# Altium project Power Module (Type-A).PrjPcb
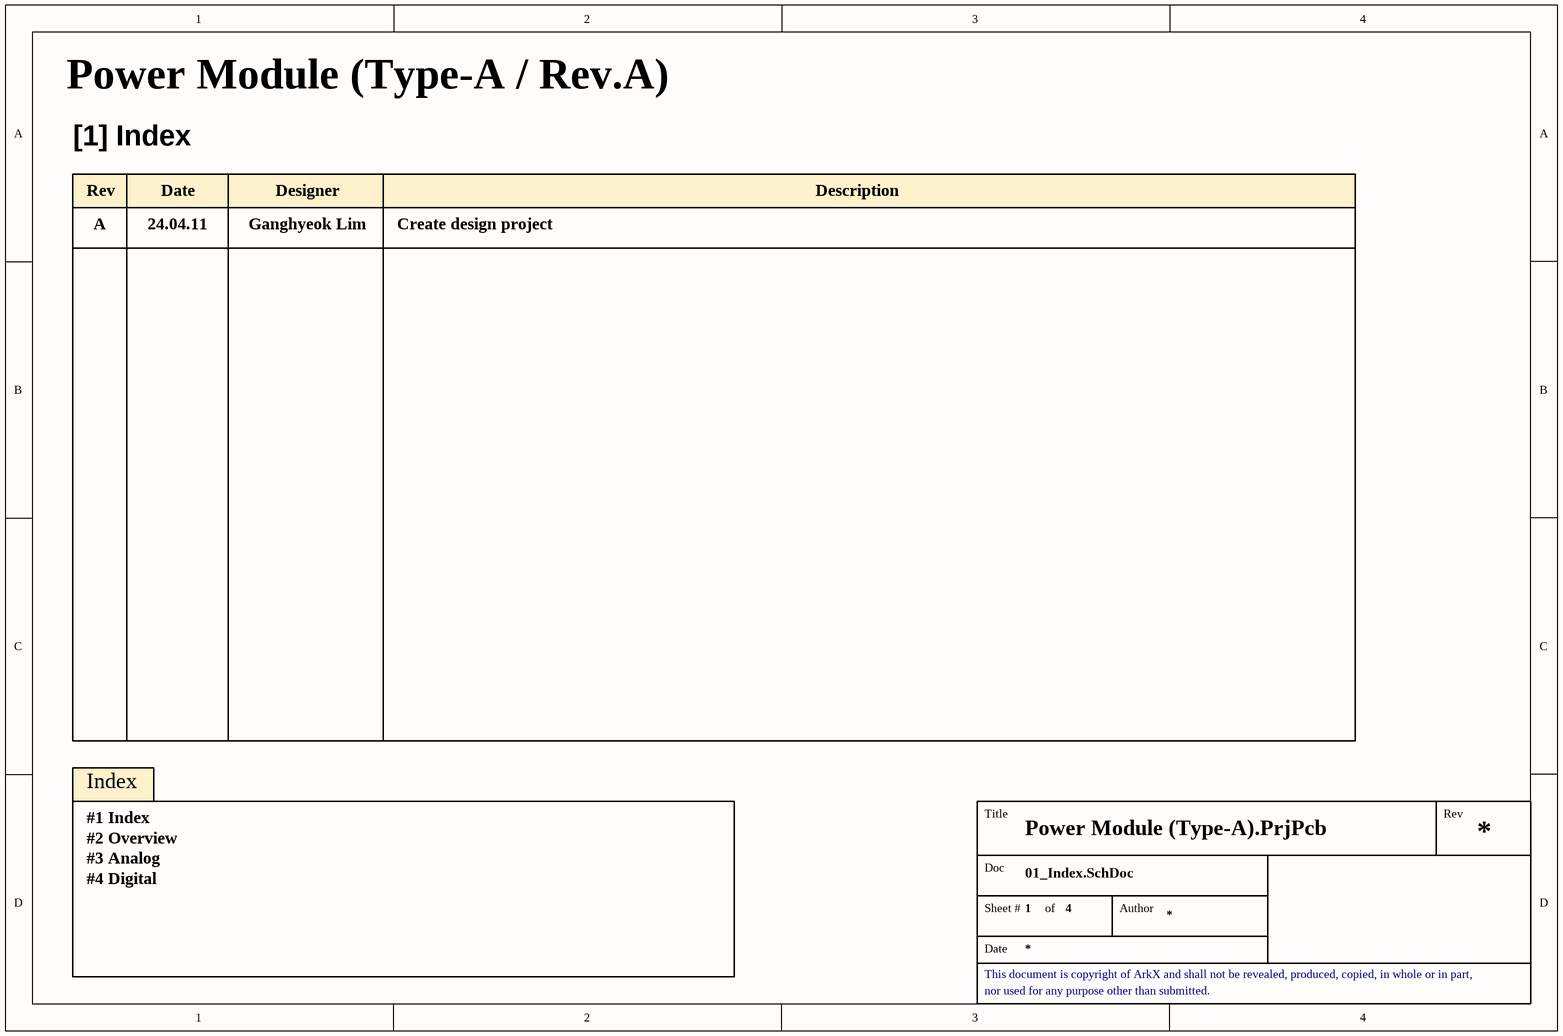
[diagram p0: 01_Index.SchDoc]
4 sheets, 55 parts. Net scope: global (net labels, ports and power ports of the same name join across sheets).
Board file: Power_Module_(Type-A).PcbDoc
Sheets:
  01_Index.SchDoc
  02_Overview.SchDoc
  03_DC-DC_Converter.SchDoc
  04_Connector.SchDoc

## Sheet 01_Index.SchDoc
size A4; SheetNumber: 1; SheetTotal: 4

### Notes on the sheet
- Power Module (Type-A / Rev.A)
- [1] Index
- Rev
- A
- 24.04.11
- Date
- Ganghyeok Lim
- Designer
- Create design project
- Description
- Index
- #1 Index
- #2 Overview
- #3 Analog
- #4 Digital
- Title
- Doc
- Sheet #
- of
- Author
- This document is copyright of ArkX and shall not be revealed, produced, copied, in whole or in part,
- nor used for any purpose other than submitted.

## Sheet 02_Overview.SchDoc
size A4; SheetNumber: 2; SheetTotal: 3
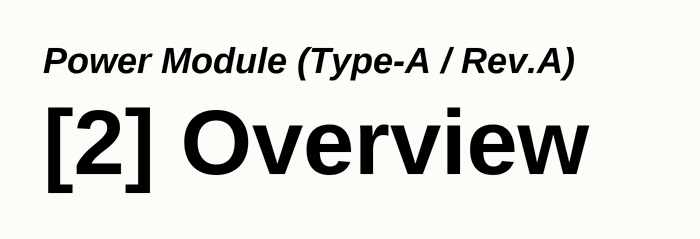
[diagram p1: 02_Overview.SchDoc]

### Notes on the sheet
- Power Module (Type-A / Rev.A)
- [2] Overview
- Title
- Rev
- Doc
- Sheet #
- of
- Author
- This document is copyright of ArkX and shall not be revealed, produced, copied, in whole or in part,
- Date
- nor used for any purpose other than submitted.

## Sheet 03_DC-DC_Converter.SchDoc
size A3; SheetNumber: 3; SheetTotal: 4
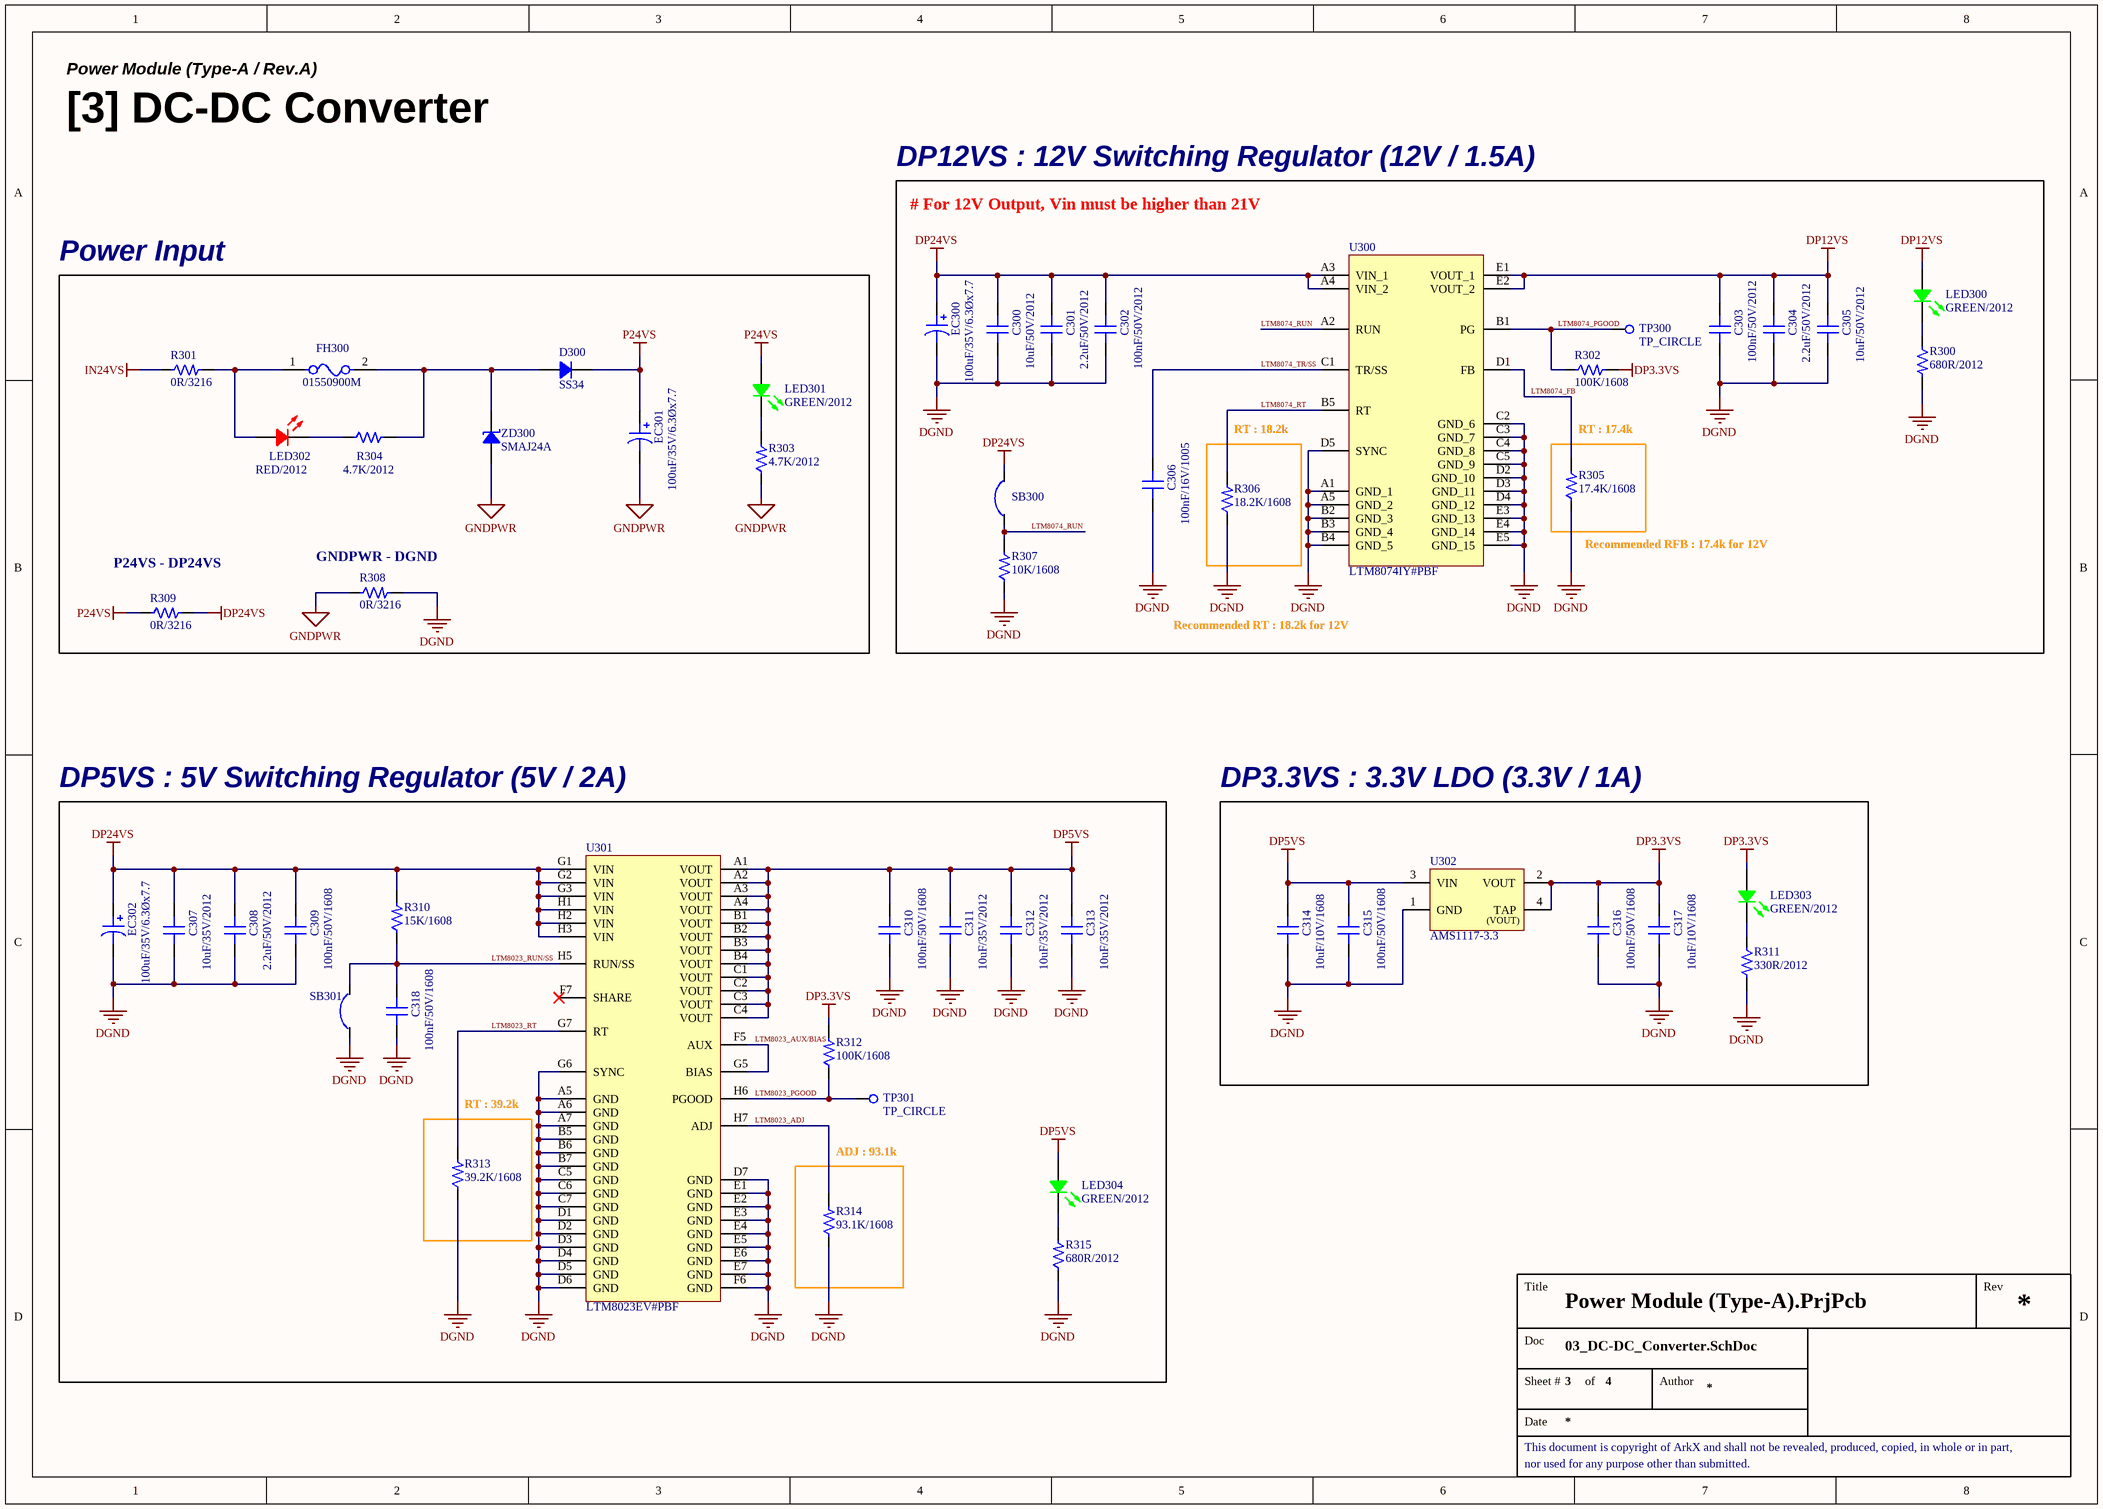
[diagram p2: 03_DC-DC_Converter.SchDoc]

### Parts
C300  10uF/50V/2012  [CAP 2012 (0805_INCH)]
C301  2.2uF/50V/2012  [CAP 2012 (0805_INCH)]
C302  100nF/50V/2012  [CAP 2012 (0805_INCH)]
C303  100nF/50V/2012  [CAP 2012 (0805_INCH)]
C304  2.2uF/50V/2012  [CAP 2012 (0805_INCH)]
C305  10uF/50V/2012  [CAP 2012 (0805_INCH)]
C306  100nF/16V/1005  [CAP 1005 (0402_INCH)]
C307  10uF/35V/2012  [CAP 2012 (0805_INCH)]
C308  2.2uF/50V/2012  [CAP 2012 (0805_INCH)]
C309  100nF/50V/1608  [CAP 1608 (0603_INCH)]
C310  100nF/50V/1608  [CAP 1608 (0603_INCH)]
C311  10uF/35V/2012  [CAP 2012 (0805_INCH)]
C312  10uF/35V/2012  [CAP 2012 (0805_INCH)]
C313  10uF/35V/2012  [CAP 2012 (0805_INCH)]
C314  10uF/10V/1608  [CAP 1608 (0603_INCH)]
C315  100nF/50V/1608  [CAP 1608 (0603_INCH)]
C316  100nF/50V/1608  [CAP 1608 (0603_INCH)]
C317  10uF/10V/1608  [CAP 1608 (0603_INCH)]
C318  100nF/50V/1608  [CAP 1608 (0603_INCH)]
D300  SS34  [DIO DO-214AC (SMA)]
EC300  100uF/35V/6.3Øx7.7  [CAP ALSMD 6.6MM H7.7MM]
EC301  100uF/35V/6.3Øx7.7  [CAP ALSMD 6.6MM H7.7MM]
EC302  100uF/35V/6.3Øx7.7  [CAP ALSMD 6.6MM H7.7MM]
FH300  01550900M  [FUSE 01550900M_SMD(Hand_Solder)]
LED300  GREEN/2012  [LED MHT170RGBCT (GREEN)]
LED301  GREEN/2012  [LED MHT170RGBCT (GREEN)]
LED302  RED/2012  [LED MHT170RGBCT (RED)]
LED303  GREEN/2012  [LED MHT170RGBCT (GREEN)]
LED304  GREEN/2012  [LED MHT170RGBCT (GREEN)]
R300  680R/2012  [RES 2012 (0805_inch)]
R301  0R/3216  [RES 3216 (1206_inch)]
R302  100K/1608  [RES 1608 (0603_inch)]
R303  4.7K/2012  [RES 2012 (0805_inch)]
R304  4.7K/2012  [RES 2012 (0805_inch)]
R305  17.4K/1608  [RES 1608 (0603_inch)]
R306  18.2K/1608  [RES 1608 (0603_inch)]
R307  10K/1608  [RES 1608 (0603_inch)]
R308  0R/3216  [RES 3216 (1206_inch)]
R309  0R/3216  [RES 3216 (1206_inch)]
R310  15K/1608  [RES 1608 (0603_inch)]
R311  330R/2012  [RES 2012 (0805_inch)]
R312  100K/1608  [RES 1608 (0603_inch)]
R313  39.2K/1608  [RES 1608 (0603_inch)]
R314  93.1K/1608  [RES 1608 (0603_inch)]
R315  680R/2012  [RES 2012 (0805_inch)]
SB300  SB  [SB (Solder-Bridge)]  (value not drawn)
SB301  SB  [SB (Solder-Bridge)]  (value not drawn)
TP300  TP_CIRCLE  [TP Circle]
TP301  TP_CIRCLE  [TP Circle]
U300  LTM8074IY#PBF  [IC_BGA-25]
U301  LTM8023EV#PBF  [LGA-50 (LTM8023EV#PBF)]
U302  AMS1117-3.3  [SOT 223-3 (DIODES INCORPORATED)]
ZD300  SMAJ24A  [DIO DO-214AC (SMA)]

### Blocks framed on the sheet
DP12VS : 12V Switching Regulator (12V / 1.5A): C300-C306 EC300 LED300 R300 R302 R307 SB300 TP300 U300
Power Input: D300 EC301 FH300 LED301 LED302 R301 R303 R304 R308 R309 ZD300
RT : 18.2k: R306
RT : 17.4k: R305
DP5VS : 5V Switching Regulator (5V / 2A): C307-C313 C318 EC302 LED304 R310 R312 R315 SB301 TP301 U301
DP3.3VS : 3.3V LDO (3.3V / 1A): C314-C317 LED303 R311 U302
RT : 39.2k: R313
ADJ : 93.1k: R314

### Nets
DGND: C300.1 C301.1 C302.1 C303.1 C304.1 C305.1 C306.1 C307.1 C308.1 C309.1 C310.1 C311.1 C312.1 C313.1 C314.1 C315.1 C316.1 C317.1 C318.1 EC300.2 EC302.2 R300.2 R305.1 R306.1 R307.1 R308.2 R311.2 R313.1 R314.1 R315.1 SB301.1 U300.A1(GND_1) U300.A5(GND_2) U300.B2(GND_3) U300.B3(GND_4) U300.B4(GND_5) U300.C2(GND_6) U300.C3(GND_7) U300.C4(GND_8) U300.C5(GND_9) U300.D2(GND_10) U300.D3(GND_11) U300.D4(GND_12) U300.D5(SYNC) U300.E3(GND_13) U300.E4(GND_14) U300.E5(GND_15) U301.A5(GND) U301.A6(GND) U301.A7(GND) U301.B5(GND) U301.B6(GND) U301.B7(GND) U301.C5(GND) U301.C6(GND) U301.C7(GND) U301.D1(GND) U301.D2(GND) U301.D3(GND) U301.D4(GND) U301.D5(GND) U301.D6(GND) U301.D7(GND) U301.E1(GND) U301.E2(GND) U301.E3(GND) U301.E4(GND) U301.E5(GND) U301.E6(GND) U301.E7(GND) U301.F6(GND) U301.G6(SYNC) U302.1(GND)
DP3.3VS: C316.2 C317.2 LED303.4(Common_Anode) R302.2 R312.2 U302.2(VOUT) U302.4(TAP)
DP5VS: C310.2 C311.2 C312.2 C313.2 C314.2 C315.2 LED304.4(Common_Anode) U301.A1(VOUT) U301.A2(VOUT) U301.A3(VOUT) U301.A4(VOUT) U301.B1(VOUT) U301.B2(VOUT) U301.B3(VOUT) U301.B4(VOUT) U301.C1(VOUT) U301.C2(VOUT) U301.C3(VOUT) U301.C4(VOUT) U302.3(VIN)
DP12VS: C303.2 C304.2 C305.2 LED300.4(Common_Anode) U300.E1(VOUT_1) U300.E2(VOUT_2)
DP24VS: C300.2 C301.2 C302.2 C307.2 C308.2 C309.2 EC300.1 EC302.1 R309.2 R310.2 SB300.2 U300.A3(VIN_1) U300.A4(VIN_2) U301.G1(VIN) U301.G2(VIN) U301.G3(VIN) U301.H1(VIN) U301.H2(VIN) U301.H3(VIN)
GNDPWR: EC301.2 R303.1 R308.1 ZD300.1
IN24VS: R301.1
P24VS: D300.2 EC301.1 LED301.4(Common_Anode) R309.1
LTM8023_ADJ: R314.2 U301.H7(ADJ)
LTM8023_AUX/BIAS: U301.F5(AUX) U301.G5(BIAS)
LTM8023_PGOOD: R312.1 TP301.1(TP) U301.H6(PGOOD)
LTM8023_RT: R313.2 U301.G7(RT)
LTM8023_RUN/SS: C318.2 R310.1 SB301.2 U301.H5(RUN/SS)
LTM8074_FB: R305.2 U300.D1(FB)
LTM8074_PGOOD: R302.1 TP300.1(TP) U300.B1(PG)
LTM8074_RT: R306.2 U300.B5(RT)
LTM8074_RUN: R307.2 SB300.1 U300.A2(RUN)
LTM8074_TR/SS: C306.2 U300.C1(TR/SS)
NetD300_1: D300.1 FH300.2 R304.2 ZD300.2
NetFH300_1: FH300.1 LED302.4(Common_Anode) R301.2
NetLED300_2: LED300.2(GREEN) R300.1
NetLED301_2: LED301.2(GREEN) R303.2
NetLED302_1: LED302.1(RED) R304.1
NetLED303_2: LED303.2(GREEN) R311.1
NetLED304_2: LED304.2(GREEN) R315.2

Not connected (* = marked no-connect by the designer): U301 F7(SHARE)*

### Notes on the sheet
- Power Module (Type-A / Rev.A)
- [3] DC-DC Converter
- # For 12V Output, Vin must be higher than 21V
- (near R309) P24VS - DP24VS
- (near R308) GNDPWR - DGND
- (near R305) Recommended RFB : 17.4k for 12V
- Recommended RT : 18.2k for 12V
- Title
- Rev
- Doc
- Sheet #
- of
- Author
- This document is copyright of ArkX and shall not be revealed, produced, copied, in whole or in part,
- Date
- nor used for any purpose other than submitted.
- (in symbol IC_REG_AMS1117-3.3) (VOUT)

### Library data of the parts
C300 C305 = CAP_10uF/50V/2012: Ceramic CAP_10uF/50V/2012; LCSC Part #: C440198; JLCPCB Part Type: Basic Part
C301 C304 C308 = CAP_2.2uF/50V/2012: Ceramic CAP_2.2uF/50V/2012; LCSC Part #: C49217; JLCPCB Part Type: Basic Part
C302 C303 = CAP_100nF/50V/2012: Ceramic CAP_100nF/50V/2012; LCSC Part #: C49678; JLCPCB Part Type: Basic Part
C306 = CAP_100nF/16V/1005: Ceramic CAP_100nF/16V/1005; LCSC Part #: C1525; JLCPCB Part Type: Basic Part
C307 C311-C313 = CAP_10uF/35V/2012: Ceramic CAP_10uF/35V/2012; LCSC Part #: C440198; JLCPCB Part Type: Basic Part
C309 C310 C315 C316 C318 = CAP_100nF/50V/1608: Ceramic CAP_100nF/50V/1608; LCSC Part #: C14663; JLCPCB Part Type: Basic Part
C314 C317 = CAP_10uF/10V/1608: Ceramic CAP_10uF/10V/1608; LCSC Part #: C19702; JLCPCB Part Type: Basic Part
D300 = DIO_SS34: DIODE SCHOTTKY 40V 3A SMC; LCSC Part #: C8678; JLCPCB Part Type: Basic Part
EC300-EC302 = CAP_EC 100uF/35V/6.3Øx7.7: Eletrolytic CAP_100uF/35V/6.3Øx7.7; LCSC Part #: C176666; JLCPCB Part Type: Extended Part
FH300 = FUSE_01550900M-SMD: Fuse Block 10A 125V 1 Circuit Cartridge Surface Mount; LCSC Part #: C108518; JLCPCB Part Type: Extended Part
LED300 LED301 LED303 LED304 = LED_MHT170RGBCT(GREEN): Colorless transparence -30℃~+85℃ Positive post Common anode RGB 120° 0805  Light Emitting Diodes (LED) ROHS; LCSC Part #: C2962094; JLCPCB Part Type: Extended Part
LED302 = LED_MHT170RGBCT(RED): Colorless transparence -30℃~+85℃ Positive post Common anode RGB 120° 0805  Light Emitting Diodes (LED) ROHS; LCSC Part #: C2962094; JLCPCB Part Type: Extended Part
R300 R315 = RES_680R/2012/0.125W: Value: 680R; Power Rating: 0.125W; Precision: 1%; Size: 2012; LCSC Part #: C17798; JLCPCB Part Type: Basic Part
R301 R308 R309 = RES_0R/3216/0.25W: Power Rating: 0.1W; Precision: 1%; Size: 1608; LCSC Part #: C17888; JLCPCB Part Type: Basic Part
R302 R312 = RES_100K/1608/0.1W: Value: 100K; Power Rating: 0.1W; Precision: 1%; Size: 1608; LCSC Part #: C25803; JLCPCB Part Type: Basic Part
R303 R304 = RES_4.7K/2012/0.125W: Value: 4.7K; Power Rating: 0.125W; Precision: 1%; Size: 2012; LCSC Part #: C17673; JLCPCB Part Type: Basic Part
R305 = RES_17.4K/1608/0.1W: Value: 17.4K; Power Rating: 0.1W; Precision: 1%; Size: 1608; LCSC Part #: C185365; JLCPCB Part Type: Extended Part
R306 = RES_18.2K/1608/0.1W: Value: 18.2K; Power Rating: 0.1W; Precision: 1%; Size: 1608; LCSC Part #: C170492; JLCPCB Part Type: Extended Part
R307 = RES_10K/1608/0.1W: Value: 10K; Power Rating: 0.1W; Precision: 1%; Size: 1608; LCSC Part #: C25804; JLCPCB Part Type: Basic Part
R310 = RES_15K/1608/0.1W: Value: 15K; Power Rating: 0.1W; Precision: 1%; Size: 1608; LCSC Part #: C22809; JLCPCB Part Type: Basic Part
R311 = RES_330R/2012/0.125W: Value: 330R; Power Rating: 0.125W; Precision: 1%; Size: 2012; LCSC Part #: C17630; JLCPCB Part Type: Basic Part
R313 = RES_39.2K/1608/0.1W: Value: 39.2K; Power Rating: 0.1W; Precision: 1%; Size: 1608; LCSC Part #: C137734; JLCPCB Part Type: Extended Part
R314 = RES_93.1K/1608/0.1W: Value: 93.1K; Power Rating: 0.1W; Precision: 1%; Size: 1608; LCSC Part #: C705799; JLCPCB Part Type: Extended Part
SB300 SB301 = SB_Solder-Bridge
U300 = IC_REG_LTM8074IY#PBF: 1.2A, 40V DC/DC Buck Module Reg; LCSC Part #: C690772; JLCPCB Part Type: Extended Part
U301 = IC_REG_LTM8023EV#PBF: 2A, 36V DC/DC Buck Module Reg; ComponentLink1Description: Datasheet; ComponentLink1URL: https://www.mouser.kr/datasheet/2/609/8023fj-2488599.pdf; LCSC Part #: C108022; JLCPCB Part Type: Extended Part
U302 = IC_REG_AMS1117-3.3: 72dB@(120Hz) 1A 1.3V@(800mA) Fixed 3.3V~3.3V Positive 1 SOT-223  Linear Voltage Regulators (LDO) ROHS; LCSC Part #: C6186; JLCPCB Part Type: Basic Part
ZD300 = DIO_SMAJ24A: Rectifier Diode; LCSC Part #: C113962; JLCPCB Part Type: Extended Part

## Sheet 04_Connector.SchDoc
size A4; SheetNumber: 4; SheetTotal: 4
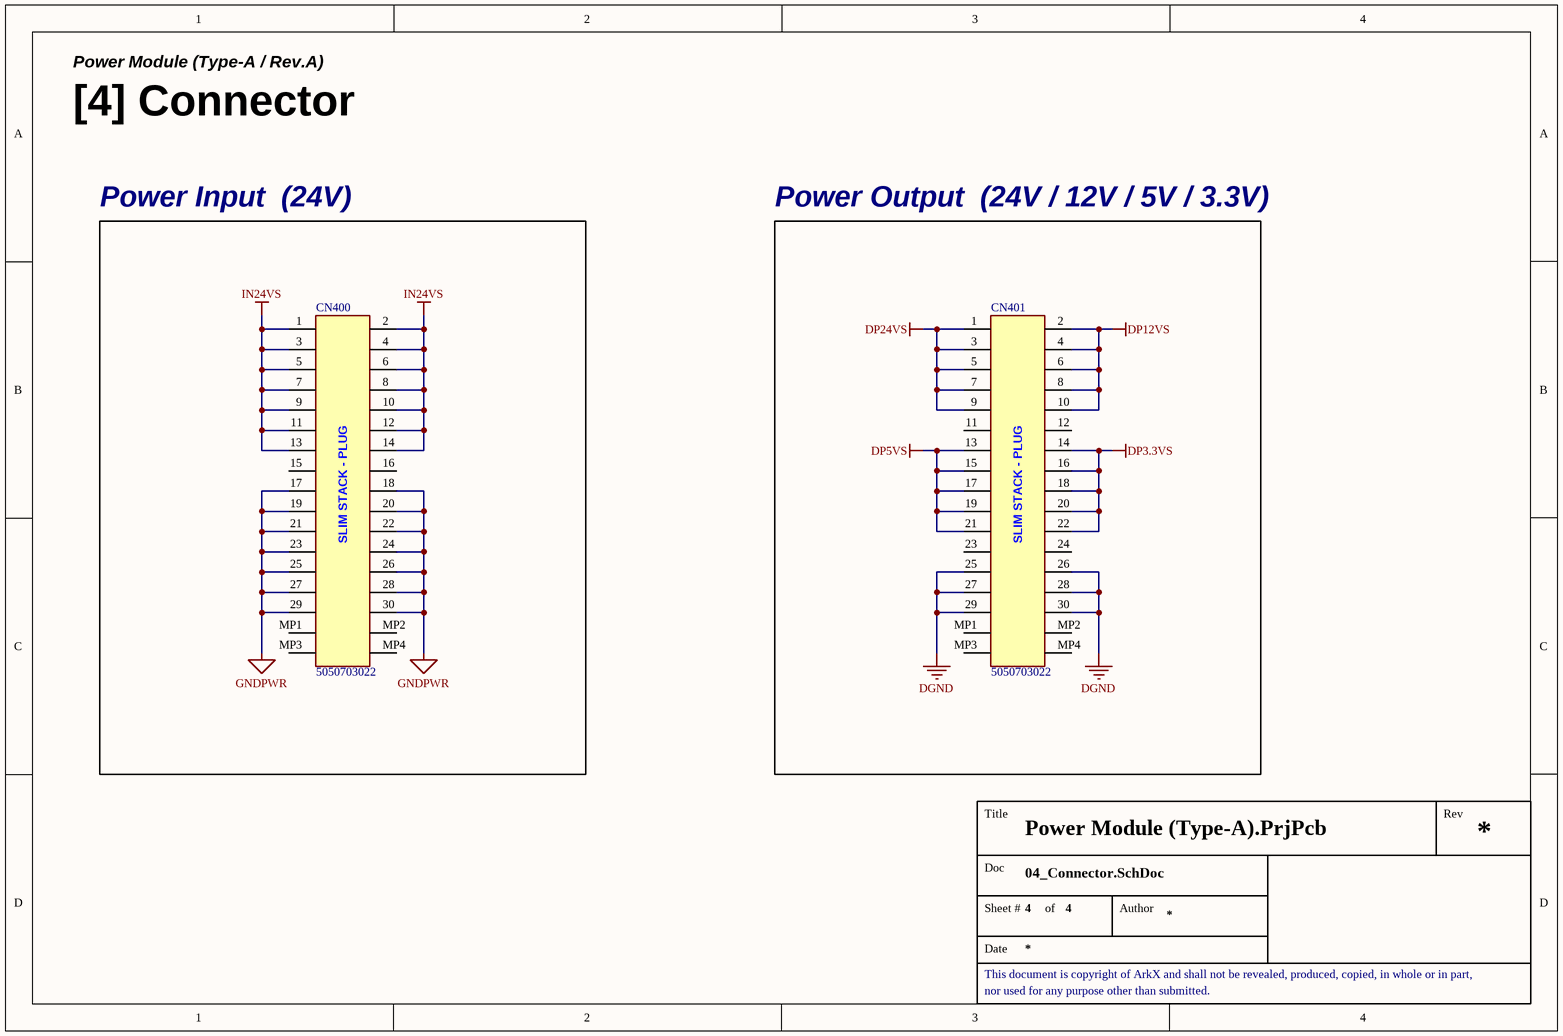
[diagram p3: 04_Connector.SchDoc]

### Parts
CN400  5050703022  [CON_SLIM-STACK_PLUG-30P]
CN401  5050703022  [CON_SLIM-STACK_PLUG-30P]

### Blocks framed on the sheet
Power Input  (24V): CN400
Power Output  (24V / 12V / 5V / 3.3V): CN401

### Nets
DGND: CN401.25 CN401.26 CN401.27 CN401.28 CN401.29 CN401.30
DP3.3VS: CN401.14 CN401.16 CN401.18 CN401.20 CN401.22
DP5VS: CN401.13 CN401.15 CN401.17 CN401.19 CN401.21
DP12VS: CN401.2 CN401.4 CN401.6 CN401.8 CN401.10
DP24VS: CN401.1 CN401.3 CN401.5 CN401.7 CN401.9
GNDPWR: CN400.17 CN400.18 CN400.19 CN400.20 CN400.21 CN400.22 CN400.23 CN400.24 CN400.25 CN400.26 CN400.27 CN400.28 CN400.29 CN400.30
IN24VS: CN400.1 CN400.2 CN400.3 CN400.4 CN400.5 CN400.6 CN400.7 CN400.8 CN400.9 CN400.10 CN400.11 CN400.12 CN400.13 CN400.14

Not connected (* = marked no-connect by the designer): CN400 15 16 MP1 MP2 MP3 MP4; CN401 11 12 23 24 MP1 MP2 MP3 MP4

### Notes on the sheet
- Power Module (Type-A / Rev.A)
- [4] Connector
- Title
- Rev
- Doc
- Sheet #
- of
- Author
- This document is copyright of ArkX and shall not be revealed, produced, copied, in whole or in part,
- Date
- nor used for any purpose other than submitted.
- (in symbol CON_SLIM-STACK_PLUG-30P) SLIM STACK - PLUG

### Library data of the parts
CN400 CN401 = CON_SLIM-STACK_PLUG-30P: 30 Position Connector Plug, Outer Shroud Contacts Surface Mount Gold; LCSC Part #: None; JLCPCB Part Type: None

## Nets that join several sheets
DGND: 03_DC-DC_Converter (73 pins), 04_Connector (6 pins)
DP3.3VS: 03_DC-DC_Converter (7 pins), 04_Connector (5 pins)
DP5VS: 03_DC-DC_Converter (20 pins), 04_Connector (5 pins)
DP12VS: 03_DC-DC_Converter (6 pins), 04_Connector (5 pins)
DP24VS: 03_DC-DC_Converter (19 pins), 04_Connector (5 pins)
GNDPWR: 03_DC-DC_Converter (EC301.2 R303.1 R308.1 ZD300.1), 04_Connector (14 pins)
IN24VS: 03_DC-DC_Converter (R301.1), 04_Connector (14 pins)